# Altium schematic sheet MAIN.SchDoc
size C; SheetNumber: 1; SheetTotal: 1
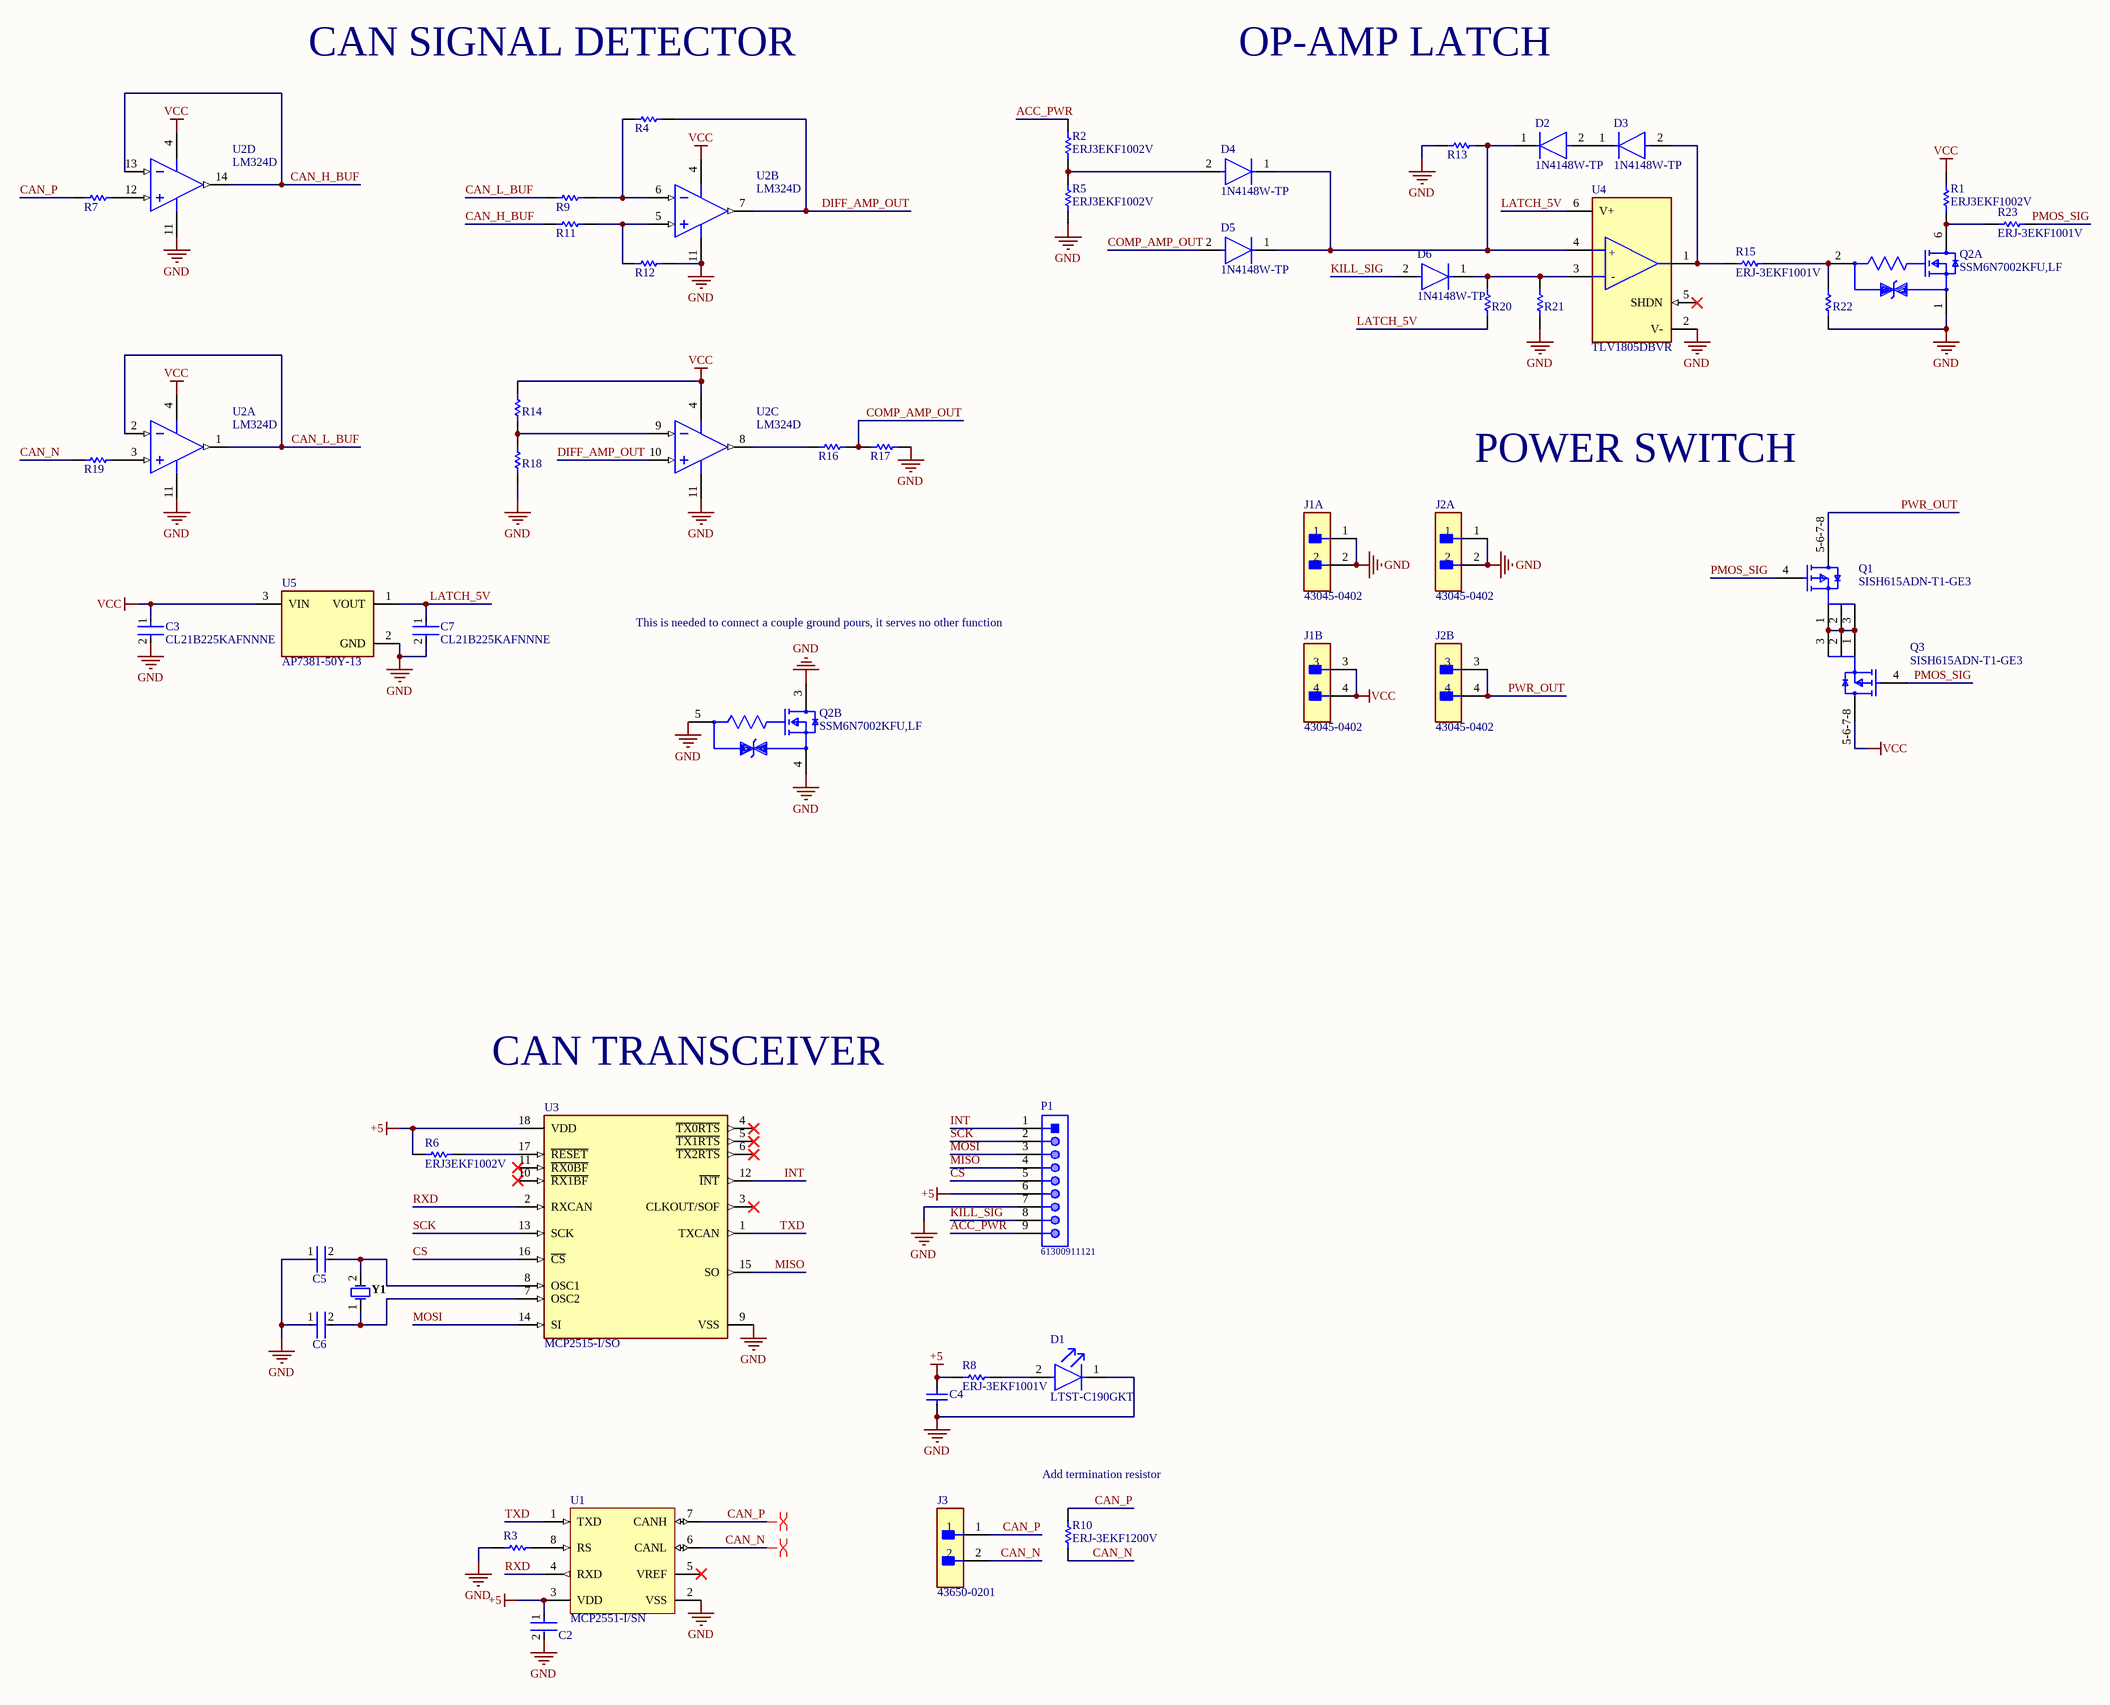
[diagram p0: MAIN.SchDoc]

## Parts
C2  C0402C104K8PACTU  [FP-C0402-BB-MFG]  (value not drawn)
C3  CL21B225KAFNNNE  [FP-0805-L_2_01_0_2-W_1_25-IPC_B]
C4  1206GC102KAT1A  [AVX-1206-2_L]  (value not drawn)
C5  GRM188R60J106ME47D  [FP-GRM188-0_1-e0_2_0_55-IPC_A]  (value not drawn)
C6  GRM188R60J106ME47D  [FP-GRM188-0_1-e0_2_0_55-IPC_A]  (value not drawn)
C7  CL21B225KAFNNNE  [FP-0805-L_2_01_0_2-W_1_25-IPC_B]
D1  LTST-C190GKT  [FP-LTST-C190GKT-MFG]
D2  1N4148W-TP  [FP-SOD-123-IPC_A]
D3  1N4148W-TP  [FP-SOD-123-IPC_A]
D4  1N4148W-TP  [FP-SOD-123-IPC_A]
D5  1N4148W-TP  [FP-SOD-123-IPC_A]
D6  1N4148W-TP  [FP-SOD-123-IPC_A]
J1  43045-0402  [FP-43045-0402-MFG]  (parts A,B of 2)
J2  43045-0402  [FP-43045-0402-MFG]  (parts A,B of 2)
J3  43650-0201  [FP-43650-0201-MFG]
P1  61300911121  [61300911121]
Q1  SISH615ADN-T1-GE3  [SISH615ADN-T1-GE3-Footprint-1]
Q2  SSM6N7002KFU,LF  [FP-SSOP6-P-0_65A-MFG]  (parts A,B of 2)
Q3  SISH615ADN-T1-GE3  [SISH615ADN-T1-GE3-Footprint-1]
R1  ERJ3EKF1002V  [RESC1609X55X30LL15T15]
R2  ERJ3EKF1002V  [RESC1609X55X30LL15T15]
R3  ERJ3EKF1002V  [RESC1609X55X30LL15T15]  (value not drawn)
R4  ERJ3EKF1002V  [RESC1609X55X30LL15T15]  (value not drawn)
R5  ERJ3EKF1002V  [RESC1609X55X30LL15T15]
R6  ERJ3EKF1002V  [RESC1609X55X30LL15T15]
R7  ERJ3EKF1002V  [RESC1609X55X30LL15T15]  (value not drawn)
R8  ERJ-3EKF1001V  [RESC1608X55X30LL15T15]
R9  ERJ3EKF1002V  [RESC1609X55X30LL15T15]  (value not drawn)
R10  ERJ-3EKF1200V  [RESC1609X55X30ML15T15]
R11  ERJ3EKF1002V  [RESC1609X55X30LL15T15]  (value not drawn)
R12  ERJ3EKF1002V  [RESC1609X55X30LL15T15]  (value not drawn)
R13  ERJ3EKF1002V  [RESC1609X55X30LL15T15]  (value not drawn)
R14  ERJ3EKF1002V  [RESC1609X55X30LL15T15]  (value not drawn)
R15  ERJ-3EKF1001V  [RESC1608X55X30LL15T15]
R16  ERJ3EKF1002V  [RESC1609X55X30LL15T15]  (value not drawn)
R17  ERJ3EKF1002V  [RESC1609X55X30LL15T15]  (value not drawn)
R18  ERJ-3EKF1001V  [RESC1608X55X30LL15T15]  (value not drawn)
R19  ERJ3EKF1002V  [RESC1609X55X30LL15T15]  (value not drawn)
R20  ERJ3EKF1002V  [RESC1609X55X30LL15T15]  (value not drawn)
R21  ERJ3EKF1002V  [RESC1609X55X30LL15T15]  (value not drawn)
R22  ERJ3EKF1002V  [RESC1609X55X30LL15T15]  (value not drawn)
R23  ERJ-3EKF1001V  [RESC1608X55X30LL15T15]
U1  MCP2551-I/SN  [MCHP-SN8_V]
U2  LM324D  [D0014A_L]  (parts A,B,C,D of 4)
U3  MCP2515-I/SO  [FP-C04-051-MFG]
U4  TLV1805DBVR  [FP-DBV0006A-IPC_C]
U5  AP7381-50Y-13  [FP-SOT89-MFG]
Y1  FOXSLF/160-20  [FOX-FOXSLF160-20]  (value not drawn)

## Nets
+5: C2.1 C4.2 P1.6 R6.1 R8.2 U1.3(VDD) U3.18(VDD)
GND: C2.2 C3.2 C4.1 C5.1 C6.1 C7.2 D1.1(C) J1.1 J1.2 J2.1 J2.2 P1.7 Q2.1(Source1) Q2.3(Drain2) Q2.4(Source2) Q2.5(Gate2) R3.1 R5.1 R12.2 R13.2 R17.1 R18.1 R21.1 R22.2 U1.2(VSS) U2.11(GND) U3.9(VSS) U4.2(V-) U5.2(GND)
VCC: C3.1 J1.3 J1.4 Q3.5-6-7-8(D) R1.2 R14.2 U2.4(VCC) U5.3(VIN)
ACC_PWR: P1.9 R2.2
CAN_H_BUF: R11.1 U2.13(4IN-) U2.14(4OUT)
CAN_L_BUF: R9.1 U2.1(1OUT) U2.2(1IN-)
CAN_N: J3.2 R10.1 R19.1 U1.6(CANL)
CAN_P: J3.1 R7.1 R10.2 U1.7(CANH)
COMP_AMP_OUT: D5.2(A) R16.1 R17.2
CS: P1.5 U3.16(~{CS})
DIFF_AMP_OUT: R4.2 U2.7(2OUT) U2.10(3IN+)
INT: P1.1 U3.12(~{INT})
KILL_SIG: D6.2(A) P1.8
LATCH_5V: C7.1 R20.1 U4.6(V+) U5.1(VOUT)
MISO: P1.4 U3.15(SO)
MOSI: P1.3 U3.14(SI)
PMOS_SIG: Q1.4(G) Q3.4(G) R23.1
PWR_OUT: J2.3 J2.4 Q1.5-6-7-8(D)
RXD: U1.4(RXD) U3.2(RXCAN)
SCK: P1.2 U3.13(SCK)
TXD: U1.1(TXD) U3.1(TXCAN)
NetC5_2: C5.2 U3.8(OSC1) Y1.2
NetC6_2: C6.2 U3.7(OSC2) Y1.1
NetD1_2: D1.2(A) R8.1
NetD2_1: D2.1(C) D4.1(C) D5.1(C) R13.1 U4.4(+IN)
NetD2_2: D2.2(A) D3.1(C)
NetD3_2: D3.2(A) R15.2 U4.1(OUT)
NetD4_2: D4.2(A) R2.1 R5.2
NetD6_1: D6.1(C) R20.2 R21.2 U4.3(-IN)
NetQ1_1: Q1.1(S) Q1.2(S) Q1.3(S) Q3.1(S) Q3.2(S) Q3.3(S)
NetQ2_2: Q2.2(Gate1) R15.1 R22.1
NetQ2_6: Q2.6(Drain1) R1.1 R23.2
NetR3_2: R3.2 U1.8(RS)
NetR4_1: R4.1 R9.2 U2.6(2IN-)
NetR6_2: R6.2 U3.17(~{RESET})
NetR7_2: R7.2 U2.12(4IN+)
NetR11_2: R11.2 R12.1 U2.5(2IN+)
NetR14_1: R14.1 R18.2 U2.9(3IN-)
NetR16_2: R16.2 U2.8(3OUT)
NetR19_2: R19.2 U2.3(1IN+)

Not connected (* = marked no-connect by the designer): U1 5(VREF)*; U3 3(CLKOUT/SOF)* 4(~{TX0RTS})* 5(~{TX1RTS})* 6(~{TX2RTS})* 10(~{RX1BF})* 11(~{RX0BF})*; U4 5(SHDN)*

## Layout directives
differential pair: CAN_N, CAN_P

## Notes on the sheet
- CAN SIGNAL DETECTOR
- OP-AMP LATCH
- POWER SWITCH
- This is needed to connect a couple ground pours, it serves no other function
- CAN TRANSCEIVER
- (near R10) Add termination resistor
- (in symbol CMP-04896-000098-1) +; -

## Library data of the parts
C2 = CMP-2008-02046-2: CAP CER 0.1UF 10V X5R 0402; Manufacturer: Kemet; Material: Ceramic; Capacitance: 0.10 μF; Temperature Coefficient: 15%; Tolerance: 0.1; Value: 0.10 μF; Package: C0402-BB; Temperature: -55°C to +125°C; ComponentLink2Description: Datasheet; Temperature Characteristic: X5R; Device Class L1: Passive Components; Height: 0.55mm; Lead Free: Yes; ComponentLink2URL: https://content.kemet.com/datasheets/KEM_C1002_X7R_SMD.pdf; Device Class L2: Capacitors; Temperature Range Low: -55°C; Temperature Range High: +125°C; RoHS: TRUE; Octopart: https://octopart.com/c0402c104k8pactu-kemet-140039; Automotive: No; Mouser Description: Capacitor 100 nF 10 VDC 0402; Category: Cap; Voltage Rating: 10 V; Digikey Description: CAP CER 0.1UF 10V X5R 0402; Ipc Land Pattern Name: CAPC10050X50; Device Class L3: Ceramic Capacitors; Manufacturer Part Number: C0402C104K8PACTU
C3 C7 = CMP-2007-04514-2: Voltage Rating (DC): 25V; Tolerance: 10%; Capacitance: 2.2uF; Dielectric: X7R; RoHS Compliant: Yes; Lead Free: Lead Free; Packaging: Tape and Reel; Case Code (Imperial): 0805; Case/Package: 0805; Contact Plating: Tin; Mount: Surface Mount; Construction: Flat; Voltage: 25V; REACH SVHC: No SVHC; Thickness: 0.06inch; Depth: 1.25mm; Max Operating Temperature: 125°C; Package Quantity: 3000; Width: 0.049inch; Height: 1.52mm; Case Code (Metric): 2012; Number of Pins: 2; Termination: SMD/SMT; Voltage Rating: 25V; Radiation Hardening: No; Series: FlEXITERM; Length: 2.01mm; Min Operating Temperature: -55°C
C4 = CMP-2000-05468-1: Chip Capacitor, 1 nF, +/- 10%, -55 to 125 degC, 1206 (3216 Metric), RoHS, Tape and Reel; Manufacturer: AVX; Capacitance: 0.001uF; Dielectric: X7R; Voltage Rating DC: 2000V; Package Reference: 1206; Datasheet Version: 11/2010; Mounting Technology: SurfaceMount; Manufacturer URL: http://www.avx.com/; Tolerance: 10%; Tolerance (%): ±10%; PartNumber: 1206GC102KAT1A; Datasheet URL: https://datasheet.ciiva.com/11787/0900766b80ed4c37-11787781.pdf; Package Description: 2-Pin SMD, Body 3.4 x 1.8 mm; Case Size/Dimension: 1206; Rated Voltage: 2000V
C5 C6 = CMP-2006-02792-2: Chip Multilayer Ceramic Capacitors for General Purpose, 0603, 10uF, X5R, 15%, 20%, 6.3V; Packaging: Tape and Reel; Voltage Rating (DC): 6.3V; Width: 0.031inch; Termination: SMD/SMT; Dielectric: X5R; Package Quantity: 4000; Voltage Rating: 6.3V; Capacitance: 10uF; Case/Package: 0603; Min Operating Temperature: -55°C; Voltage: 6.3V; Length: 1.6mm; Thickness: 0.035inch; Lead Free: Lead Free; Depth: 0.8mm; Case Code (Imperial): 0603; Max Operating Temperature: 85°C; Material: Ceramic; Height: 0.8mm; Tolerance: 20%; Mount: Surface Mount; REACH SVHC: No SVHC; Radiation Hardening: No; Case Code (Metric): 1608
D1 = CMP-22017-000005-2: LED GREEN CLEAR CHIP SMD; Dominant Wavelength: 569nm; Reverse Voltage: 5V; Lens Color: Colorless; Viewing Angle: 130°; Voltage: 2V; Forward Current: 30mA; Power Dissipation: 100mW; Luminous Intensity: 6mcd; Number of LEDs: 1; Forward Voltage: 2.1V; Wavelength: 565nm; Test Current: 10mA; Min Operating Temperature: -55°C; Lens Style: Clear; Mount: Surface Mount; Width: 0.8mm; Packaging: Tape and Reel; Lens Transparency: Clear; Case Code (Metric): 1608; Depth: 0.8mm; Case Code (Imperial): 0603; Case/Package: 0603; Number of Pins: 2; Max Operating Temperature: 85°C; Lead Free: Lead Free; Number of Elements: 1; Length: 1.6mm; Height: 0.8mm; Package Quantity: 1; Power Rating: 100mW; Radiation Hardening: No; Illumination Color: Green; Color: Green
D2-D6 = CMP-2000-04993-2: DIODE GEN PURP 100V 150MA SOD123; Max Reverse Leakage Current: 5uA; Max Surge Current: 2A; Reverse Recovery Time: 4ns; Polarity: Standard; Capacitance: 4pF; Max Forward Surge Current (Ifsm): 1A; Element Configuration: Single; Power Dissipation: 400mW; Forward Voltage: 1V; Radiation Hardening: No; Lead Free: Lead Free; Max Reverse Voltage (DC): 100V; Current Rating: 150mA; Forward Current: 150mA; Packaging: Tape and Reel; Number of Pins: 2; Package Quantity: 3000; Max Operating Temperature: 150°C; Min Operating Temperature: -65°C; Average Rectified Current: 150mA; Recovery Time: 4ns; Output Current: 150mA; Peak Non-Repetitive Surge Current: 2A; Width: 1.8mm; Voltage Rating (DC): 100V; Height: 1.2mm; Max Repetitive Reverse Voltage (Vrrm): 100V; Mount: Surface Mount; Length: 2.85mm
J1 J2 = CMP-04776-000323-1: CONN HEADER R/A 4POS 3MM; Contact Resistance: 10mR; Glow Wire Compliant: Compliant; Gender: Male; Number of Contacts: 4; Voltage Rating (DC): 250V; Max Current Rating: 5A; Insulation Resistance: 1GR; Max Voltage Rating (DC): 250.25kV; Voltage Rating: 600V; Orientation: Right Angle; Package Quantity: 2232; Flammability Rating: UL94 V-0; Halogen Free: Low Halogen; Lead Free: Lead Free; Max Operating Temperature: 105°C; Length: 10.15mm; Termination: Solder; Row Spacing: 3mm; Color: Black; Height: 8.77mm; Current Rating: 5A; Case/Package: 0402; Contact Gender: Male; Packaging: Tray; Contact Material: Brass; Contact Plating: Gold; Housing Material: Thermoplastic; Housing Color: Black; Diameter: 3mm; Pitch: 3mm; Depth: 12.2mm; Min Operating Temperature: -40°C; Number of Positions: 4; Mount: Through Hole; Series: Micro-Fit 3.0; Number of Rows: 2; Number of Circuits: 4
J3 = CMP-04776-000557-1: CONN HEADER R/A 2POS 3MM; Voltage Rating: 600V; Number of Circuits: 2; Insulation Resistance: 1GR; Current Rating: 5A; Voltage Rating (DC): 250V; Contact Resistance: 10mR; Gender: Male; Number of Ports: 1; Glow Wire Compliant: Compliant; Pitch: 3mm; Contact Plating: Gold; Series: 43650; Color: Black; Max Operating Temperature: 105°C; Radiation Hardening: No; Orientation: Right Angle; Number of Terminals/Pins: 2; Length: 9.65mm; Case/Package: 0201; Halogen Free: Low Halogen; Housing Color: Black; Min Operating Temperature: -40°C; Package Quantity: 3927; Contact Material: Brass; Number of Rows: 1; Number of Positions: 2; Termination: Solder; Depth: 9.9mm; Mount: Through Hole; Packaging: Tray; Number of Contacts: 2; Housing Material: Thermoplastic; Flammability Rating: UL94 V-0
P1 = CMP-1502-01080-1: THT Vertical Pin Header WR-PHD, Pitch 2.54 mm, Single Row, 9 pins; Manufacturer: Wurth Elektronik; Pitch: 2.54mm; Gender: Male; Working Voltage: 250VAC; Contact Resistance: 20mOhm; Withstanding Voltage: 500VAC; Pin Number: 9; Rated Current: 3A; Package Reference: 61300911121; Part Number: 61300911121; Mounting Technology: THT; Publisher: WurthElektronik; Manufacturer URL: http://www.we-online.de; Orientation: Vertical; Datasheet URL: https://katalog.we-online.de/em/datasheet/6130xx11121.pdf; Operating Temperature: -40to105degC; Row Number: Single; Packaging: Bag
Q1 Q3 = CMP-013-00036-1: Trans MOSFET P-CH 20V 22.1A 8-Pin PowerPAK 1212 EP T/R
Q2 = CMP-35916-000009-1: MOSFET 2N-CH 60V 0.3A; Input Capacitance: 40pF; Continuous Drain Current (ID): 300mA; Max Power Dissipation: 285mW; FET Type: 2 N-Channel; Rds On Max: 1.5R; Mount: Surface Mount; Drain to Source Voltage (Vdss): 60V; Packaging: Tape and Reel
R1-R7 R9 R11-R14 R16 R17 R19-R22 = CMP-1012-00623-3: Chip Resistor, 10 KOhm, +/- 1%, 0.1 W, -55 to 155 degC, 0603 (1608 Metric), RoHS, Tape and Reel; Manufacturer: Panasonic; Voltage Rating: 75V; Case\/Package: 0603; Power Rating: 100mW; Resistance: 10KOhm; Temperature Coefficient: 100ppm\/degreesC; Number of Pins: 2; Package Reference: 603; Depth: 0.8mm; Mount: SurfaceMount; Package Description: 2-Pin Surface Mount Device, Body 1.6 x 0.85 mm; Datasheet Version: 02/2017; Length: 1.6mm; Lead Free: LeadFree; Height: 0.45mm; Number of Terminations: 2; Max Power Dissipation: 100mW; Min Operating Temperature: -55degC; Datasheet URL: https://industrial.panasonic.com/cdbs/www-data/pdf/RDA0000/AOA0000C304.pdf; Termination: SMD/SMT; Case Code (Metric): 1608; Case Code (Imperial): 0603; Tolerance: 1%; Max Operating Temperature: 155degC; RoHSCompliant: true; Voltage Rating (DC): 75V; Radiation Hardening: No; Packaging: TapeandReel; Composition: ThickFilm; Mounting Technology: SurfaceMount; Manufacturer URL: http://www.panasonic.com/; Width: 0.031inch; REACH SVHC: NoSVHC; Contact Plating: Tin; Military Standard: Not; Package Quantity: 1
R8 R15 R18 R23 = CMP-2000-00180-1: Manufacturer: Panasonic; Part Number: ERJ-3EKF1001V
R10 = CMP-2000-00213-2: Chip Resistor, 120 Ohm, +/- 1%, 0.1 W, -55 to 155 degC, 0603 (1608 Metric), RoHS, Tape and Reel; Manufacturer: Panasonic; Power Rating: 100mW; Voltage Rating (DC): 75V; Resistance: 120Ohm; Temperature Coefficient: 100ppm/degreesC; Number of Terminations: 2; Military Standard: Not; Tolerance: 1%; Min Operating Temperature: -55degC; Packaging: TapeandReel; Lead Free: LeadFree; Max Operating Temperature: 155degC; Manufacturer URL: http://www.panasonic.com/; Case Code (Imperial): 0603; REACH SVHC: NoSVHC; Width: 0.031inch; Datasheet URL: https://industrial.panasonic.com/cdbs/www-data/pdf/RDA0000/AOA0000C283.pdf; RoHSCompliant: true; Max Power Dissipation: 100mW; Termination: SMD/SMT; Package Reference: 0603; Height: 0.022inch; Depth: 0.8mm; Package Description: 2-Pin Surface Mount Device, Body 1.6 x 0.85 mm; Contact Plating: Tin; Length: 1.6mm; Package URL: http://www.st.com/st-web-ui/static/active/en/resource/technical/document/datasheet/CD00001320.pdf; Radiation Hardening: No; Package Quantity: 1; Number of Pins: 2; Datasheet Version: 42095.0; Voltage Rating: 75V; Composition: ThickFilm; Case/Package: 0603; Mount: SurfaceMount; Case Code (Metric): 1608
U1 = CMP-0186-00138-3: High-Speed CAN Transceiver, / 1 Mb/s, 4.5 to 5.5 V, 8-Pin SOIC (SN), Industrial Temperature, RoHS, Tube; Manufacturer: Microchip; RoHSCompliant: true; PackageReference: SN8; ComponentLink1URL: http://www.microchip.com/; DatasheetVersion: Rev. F, 07/2010; ComponentLink2Description: Datasheet; ComponentLink2URL: http://ww1.microchip.com/downloads/en/DeviceDoc/21667f.pdf; ComponentLink3Description: Package Specification; PackageDescription: 8-Pin Small Outline Integrated Circuit, Body 4.9 x 3.9 mm, Pitch 1.27 mm; ComponentLink1Description: Manufacturer URL; Mounting Technology: Surface Mount; ComponentLink3URL: http://www.microchip.com/stellent/groups/techpub_sg/documents/packagingspec/en012702.pdf
U2 = CMP-2000-06547-1: Quadruple Operational Amplifier, 0.5 V/us, 1.2 MHz, 3 to 32 V, 0 to 70 degC, 14-Pin SOIC (D), Green (RoHS & no Sb/Br), Tube; Manufacturer: Texas Instruments; Unity Gain Bandwidth Product: 1.2MHz; Input Offset Voltage: 7mV; Dual Supply Voltage (Max): ±16V; Single Supply Voltage (Min): 3V; Single Supply Voltage (Max): 32V; Voltage Gain in dB: 100dB; Power Supply Requirement: Single/Dual; Input Bias Current: 250nA; Dual Supply Voltage (Min): ±1.5V; Single Supply Voltage (Typ): 5/9/12/15/18/24/28V; Dual Supply Voltage (Typ): ±3/±5/±9/±12/±15V; Number of  Elements: 4; Common Mode Rejection Ratio: 65dB; Datasheet Version: Rev. W, 03/2015; Technology: Bipolar; Shut Down Feature: No; Package Reference: D0014A; Type: GeneralPurposeAmplifier; Pin Count: 14; Package Type: SOIC; Rail/Rail I/O Type: No; Manufacturer URL: http://www.ti.com/; Package Description: 14-Pin Small Outline Integrated Circuit, Body 8.65 x 3.9 mm, Pitch 1.27 mm; Operating Temperature Classification: Commercial; Datasheet URL: http://www.ti.com/lit/ds/symlink/lm324.pdf; Slew Rate: 0.5V/us; Package URL: http://www.ti.com/lit/ml/mpds177g/mpds177g.pdf; Mounting: SurfaceMount; Packaging: Rail/Tube; Mounting Technology: SurfaceMount; Operating Temp Range: 0Cto70C
U3 = CMP-0186-00133-3: IC CAN CONTROLLER W/SPI 18SOIC; Manufacturer: Microchip; Min Supply Voltage: 2.7V; Max Supply Voltage: 5.5V; Standoff Height: 0.1mm; Nominal Supply Current: 10mA; Interface: SPI,CAN; Lead Free: Yes; Digikey Description: IC CAN CONTROLLER W/SPI 18SOIC; Category: IC; RoHS: TRUE; Manufacturer Part Number: MCP2515-I/SO; ComponentLink2URL: http://ww1.microchip.com/downloads/en/DeviceDoc/MCP2515-Stand-Alone-CAN-Controller-with-SPI-20001801J.pdf; Mouser Description: CAN Interface IC W/ SPI Interface; Device Class L2: Interface ICs; Package: C04-051; Automotive: No; Function: Controller; Octopart: https://octopart.com/mcp2515-i%2Fso-microchip-430187; Temperature: -40°C to +85°C; Ipc Land Pattern Name: SOIC127P1030X265-18; Ambient Temperature Range Low: -65°C; Height: 2.65mm; Device Class L1: Integrated Circuits (ICs); Ambient Temperature Range High: +125°C; Footprint Url: http://ww1.microchip.com/downloads/en/DeviceDoc/18L_SOIC_Wide_7.50_SO_C04-0051D.pdf; Temperature Range Low: -40°C; Device Class L3: Controllers; Temperature Range High: +85°C; ComponentLink2Description: Datasheet
U4 = CMP-04896-000098-1: 40V, RAIL-TO-RAIL INPUT, PUSH-PU
U5 = CMP-12756-000009-1: IC REG LINEAR 5V 150MA SOT89; Manufacturer: Diodes Inc.; Output Type: Fixed; Min Supply Voltage: 3.3V; Max Junction Temp: +125°C; Max Supply Voltage: 40V; Nominal Supply Current: 2.5-25uA; Number Of Outputs: 1; Dropout Voltage: 1000mV; Manufacturer Part Number: AP7381-50Y-13; RoHS: TRUE; Digikey Description: IC REG LINEAR 5V 150MA SOT89; Output Voltage: 5V; Footprint Url: https://www.diodes.com/assets/Package-Files/SOT89.pdf; Category: IC; Temperature: -40°C to +125°C; ComponentLink2Description: Datasheet; Package: SOT89; Temperature Range Low: -40°C; Temperature Range High: +125°C; ComponentLink2URL: https://www.diodes.com/assets/Datasheets/AP7381.pdf; Device Class L1: Integrated Circuits (ICs); Automotive: No; Output Current: 150mA; Ambient Temperature Range High: +85°C; Octopart: https://octopart.com/ap7381-50y-13-diodes+inc.-87775116; Lead Free: Yes; Device Class L2: Power Management ICs; Height: 1.6mm; Device Class L3: Voltage Regulators - Linear; Ambient Temperature Range Low: -40°C
Y1 = CMP-1749-00003-1: Resistance Weld Thru-Hole Crystal, 16 MHz, -20 to 70 degC, 2-Pin THD, RoHS, Bulk; Voltage Rating: 250 V; Tolerance: 1%; Resistance: 221 kohm; Case\Package: Axial; Power Rating: 250 mW; RoHSCompliant: true; Package Quantity: 200; Packaging: Bulk; Min Operating Temperature: -55 degC; DatasheetVersion: Mar-15; ComponentLink1URL: http://www.foxonline.com/; Max Operating Temperature: 155 degC; PackageReference: FOXSLF160-20; Mount: Through Hole; PackageDescription: 2-Pin Through Hole Device, Body 11.35 x 4.65 mm; ComponentLink1Description: Manufacturer URL; ComponentLink2URL: http://www.foxonline.com/pdfs/hc49slf.pdf; ComponentLink2Description: Datasheet; Length: 0.248 inch